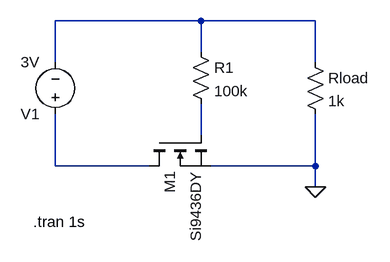
[diagram p0: schematic NMOS_protection.asc]
NMOS_protection.asc, the LTspice schematic file:
Version 4
SHEET 1 880 680
WIRE 320 96 96 96
WIRE 496 96 320 96
WIRE 320 144 320 96
WIRE 96 160 96 96
WIRE 496 160 496 96
WIRE 320 272 320 224
WIRE 96 320 96 240
WIRE 240 320 96 320
WIRE 496 320 496 240
WIRE 496 320 336 320
WIRE 496 352 496 320
FLAG 496 352 0
SYMBOL voltage 96 256 R180
WINDOW 123 0 0 Left 0
WINDOW 39 0 0 Left 0
SYMATTR InstName V1
SYMATTR Value 3V
SYMBOL nmos 240 272 M90
SYMATTR InstName M1
SYMATTR Value Si9436DY
SYMBOL res 304 128 R0
SYMATTR InstName R1
SYMATTR Value 100k
SYMBOL res 480 144 R0
SYMATTR InstName Rload
SYMATTR Value 1k
TEXT 62 406 Left 2 !.tran 1s

The netlist it stands for:
* NMOS_protection.asc
V1 N003 N001 3V
M1 N003 N002 0 0 Si9436DY
R1 N001 N002 100k
Rload N001 0 1k
.model NMOS NMOS
.model PMOS PMOS
.lib standard.mos
.tran 1s
.backanno
.end